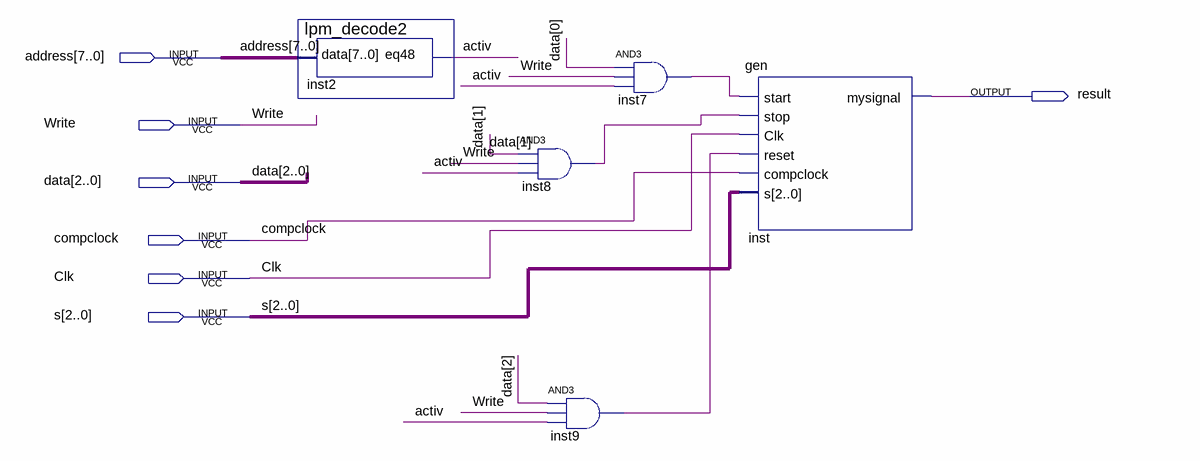
[diagram p0: schematic sheet]
// Quartus schematic interf.bdf as structural Verilog: 5 symbols, 7 pins
module interf (
  input  [7:0] address,
  input  Write,
  input  [2:0] data,
  input  compclock,
  input  Clk,
  input  [2:0] s,
  output result
);

  wire activ, inst7_out, inst8_out, inst9_out;

  lpm_decode2 inst2 (.data(address), .eq48(activ));
  and inst8 (inst8_out, data[1], Write, activ);
  and inst9 (inst9_out, data[2], Write, activ);
  and inst7 (inst7_out, data[0], Write, activ);
  gen inst (
    .start(inst7_out), .stop(inst8_out), .Clk(Clk), .reset(inst9_out), .compclock(compclock), .s(s),
    .mysignal(result));
endmodule
